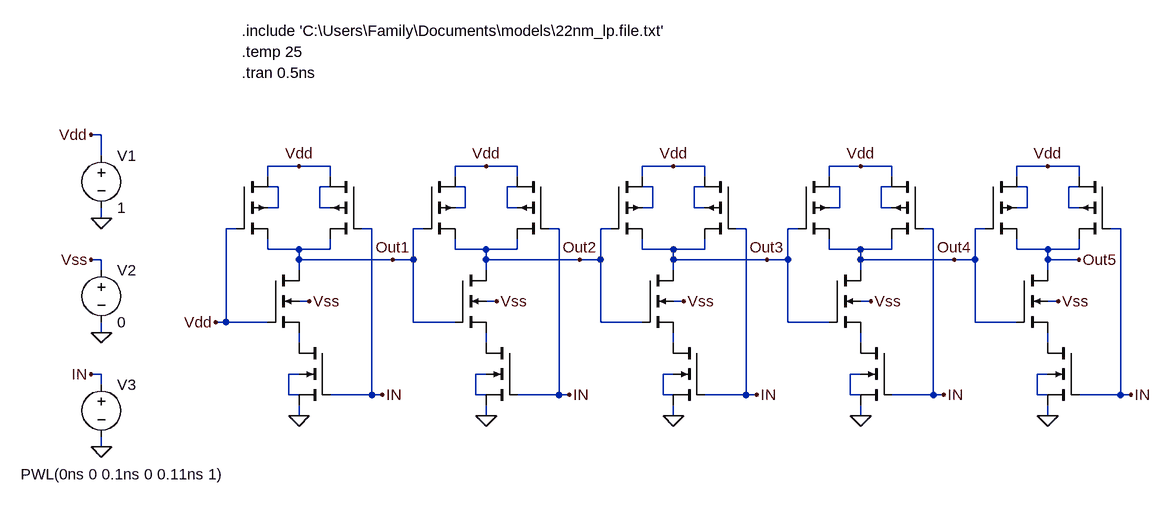
[diagram p0: schematic HW3_q1a.asc]
HW3_q1a.asc, the LTspice schematic file:
Version 4
SHEET 1 1404 720
WIRE -224 96 -240 96
WIRE -224 128 -224 96
WIRE 80 144 32 144
WIRE 128 144 80 144
WIRE 368 144 320 144
WIRE 416 144 368 144
WIRE 656 144 608 144
WIRE 704 144 656 144
WIRE 944 144 896 144
WIRE 992 144 944 144
WIRE 1232 144 1184 144
WIRE 1280 144 1232 144
WIRE 32 160 32 144
WIRE 128 160 128 144
WIRE 320 160 320 144
WIRE 416 160 416 144
WIRE 608 160 608 144
WIRE 704 160 704 144
WIRE 896 160 896 144
WIRE 992 160 992 144
WIRE 1184 160 1184 144
WIRE 1280 160 1280 144
WIRE 48 176 32 176
WIRE 128 176 112 176
WIRE 336 176 320 176
WIRE 416 176 400 176
WIRE 624 176 608 176
WIRE 704 176 688 176
WIRE 912 176 896 176
WIRE 992 176 976 176
WIRE 1200 176 1184 176
WIRE 1280 176 1264 176
WIRE 48 208 48 176
WIRE 48 208 32 208
WIRE 112 208 112 176
WIRE 128 208 112 208
WIRE 336 208 336 176
WIRE 336 208 320 208
WIRE 400 208 400 176
WIRE 416 208 400 208
WIRE 624 208 624 176
WIRE 624 208 608 208
WIRE 688 208 688 176
WIRE 704 208 688 208
WIRE 912 208 912 176
WIRE 912 208 896 208
WIRE 976 208 976 176
WIRE 992 208 976 208
WIRE 1200 208 1200 176
WIRE 1200 208 1184 208
WIRE 1264 208 1264 176
WIRE 1280 208 1264 208
WIRE -224 224 -224 208
WIRE -16 240 -32 240
WIRE 192 240 176 240
WIRE 272 240 256 240
WIRE 480 240 464 240
WIRE 560 240 544 240
WIRE 768 240 752 240
WIRE 848 240 832 240
WIRE 1056 240 1040 240
WIRE 1136 240 1120 240
WIRE 1344 240 1328 240
WIRE 32 272 32 256
WIRE 80 272 32 272
WIRE 128 272 128 256
WIRE 128 272 80 272
WIRE 320 272 320 256
WIRE 368 272 320 272
WIRE 416 272 416 256
WIRE 416 272 368 272
WIRE 608 272 608 256
WIRE 656 272 608 272
WIRE 704 272 704 256
WIRE 704 272 656 272
WIRE 896 272 896 256
WIRE 944 272 896 272
WIRE 992 272 992 256
WIRE 992 272 944 272
WIRE 1184 272 1184 256
WIRE 1232 272 1184 272
WIRE 1280 272 1280 256
WIRE 1280 272 1232 272
WIRE -224 288 -240 288
WIRE 80 288 80 272
WIRE 224 288 80 288
WIRE 256 288 256 240
WIRE 256 288 224 288
WIRE 368 288 368 272
WIRE 512 288 368 288
WIRE 544 288 544 240
WIRE 544 288 512 288
WIRE 656 288 656 272
WIRE 800 288 656 288
WIRE 832 288 832 240
WIRE 832 288 800 288
WIRE 944 288 944 272
WIRE 1088 288 944 288
WIRE 1120 288 1120 240
WIRE 1120 288 1088 288
WIRE 1232 288 1232 272
WIRE 1280 288 1232 288
WIRE -224 304 -224 288
WIRE 80 304 80 288
WIRE 368 304 368 288
WIRE 656 304 656 288
WIRE 944 304 944 288
WIRE 1232 304 1232 288
WIRE 96 352 80 352
WIRE 384 352 368 352
WIRE 672 352 656 352
WIRE 960 352 944 352
WIRE 1248 352 1232 352
WIRE -32 384 -32 240
WIRE -32 384 -48 384
WIRE 32 384 -32 384
WIRE 256 384 256 288
WIRE 320 384 256 384
WIRE 544 384 544 288
WIRE 608 384 544 384
WIRE 832 384 832 288
WIRE 896 384 832 384
WIRE 1120 384 1120 288
WIRE 1184 384 1120 384
WIRE -224 400 -224 384
WIRE 80 416 80 400
WIRE 368 416 368 400
WIRE 656 416 656 400
WIRE 944 416 944 400
WIRE 1232 416 1232 400
WIRE -224 464 -240 464
WIRE 80 464 64 464
WIRE 368 464 352 464
WIRE 656 464 640 464
WIRE 944 464 928 464
WIRE 1232 464 1216 464
WIRE -224 480 -224 464
WIRE 64 496 64 464
WIRE 80 496 64 496
WIRE 192 496 192 240
WIRE 192 496 128 496
WIRE 208 496 192 496
WIRE 352 496 352 464
WIRE 368 496 352 496
WIRE 480 496 480 240
WIRE 480 496 416 496
WIRE 496 496 480 496
WIRE 640 496 640 464
WIRE 656 496 640 496
WIRE 768 496 768 240
WIRE 768 496 704 496
WIRE 784 496 768 496
WIRE 928 496 928 464
WIRE 944 496 928 496
WIRE 1056 496 1056 240
WIRE 1056 496 992 496
WIRE 1072 496 1056 496
WIRE 1216 496 1216 464
WIRE 1232 496 1216 496
WIRE 1344 496 1344 240
WIRE 1344 496 1280 496
WIRE 1360 496 1344 496
WIRE 80 528 80 512
WIRE 368 528 368 512
WIRE 656 528 656 512
WIRE 944 528 944 512
WIRE 1232 528 1232 512
WIRE -224 576 -224 560
FLAG -224 224 0
FLAG -224 576 0
FLAG 80 144 Vdd
FLAG -224 400 0
FLAG 96 352 Vss
FLAG 80 528 0
FLAG 368 144 Vdd
FLAG 384 352 Vss
FLAG 368 528 0
FLAG 656 144 Vdd
FLAG 672 352 Vss
FLAG 656 528 0
FLAG 944 144 Vdd
FLAG 960 352 Vss
FLAG 944 528 0
FLAG 1232 144 Vdd
FLAG 1248 352 Vss
FLAG 1232 528 0
FLAG -48 384 Vdd
FLAG 208 496 IN
FLAG 496 496 IN
FLAG 784 496 IN
FLAG 1072 496 IN
FLAG 1360 496 IN
FLAG -240 96 Vdd
FLAG -240 288 Vss
FLAG -240 464 IN
FLAG 224 288 Out1
FLAG 512 288 Out2
FLAG 800 288 Out3
FLAG 1088 288 Out4
FLAG 1280 288 Out5
SYMBOL nmos4 128 416 M0
WINDOW 0 56 32 Invisible 2
WINDOW 3 56 72 Invisible 2
SYMATTR InstName M1
SYMATTR Value2 l=0.03u w=0.8u
SYMBOL nmos4 32 304 R0
WINDOW 0 56 32 Invisible 2
WINDOW 3 56 72 Invisible 2
SYMATTR InstName M2
SYMATTR Value2 l=0.03u w=0.8u
SYMBOL pmos4 -16 160 R0
WINDOW 0 56 32 Invisible 2
WINDOW 3 56 72 Invisible 2
SYMATTR InstName M3
SYMATTR Value2 l=0.03u w=0.7u
SYMBOL pmos4 176 160 M0
WINDOW 0 56 32 Invisible 2
WINDOW 3 56 72 Invisible 2
SYMATTR InstName M4
SYMATTR Value2 l=0.03u w=0.7u
SYMBOL voltage -224 112 R0
SYMATTR InstName V1
SYMATTR Value 1
SYMBOL voltage -224 464 R0
WINDOW 3 -124 154 Left 2
WINDOW 123 0 0 Left 2
WINDOW 39 0 0 Left 2
SYMATTR Value PWL(0ns 0 0.1ns 0 0.11ns 1)
SYMATTR InstName V3
SYMBOL voltage -224 288 R0
SYMATTR InstName V2
SYMATTR Value 0
SYMBOL nmos4 416 416 M0
WINDOW 0 56 32 Invisible 2
WINDOW 3 56 72 Invisible 2
SYMATTR InstName M5
SYMATTR Value2 l=0.03u w=0.8u
SYMBOL nmos4 320 304 R0
WINDOW 0 56 32 Invisible 2
WINDOW 3 56 72 Invisible 2
SYMATTR InstName M6
SYMATTR Value2 l=0.03u w=0.8u
SYMBOL pmos4 272 160 R0
WINDOW 0 56 32 Invisible 2
WINDOW 3 56 72 Invisible 2
SYMATTR InstName M7
SYMATTR Value2 l=0.03u w=0.7u
SYMBOL pmos4 464 160 M0
WINDOW 0 56 32 Invisible 2
WINDOW 3 56 72 Invisible 2
SYMATTR InstName M8
SYMATTR Value2 l=0.03u w=0.7u
SYMBOL nmos4 704 416 M0
WINDOW 0 56 32 Invisible 2
WINDOW 3 56 72 Invisible 2
SYMATTR InstName M9
SYMATTR Value2 l=0.03u w=0.8u
SYMBOL nmos4 608 304 R0
WINDOW 0 56 32 Invisible 2
WINDOW 3 56 72 Invisible 2
SYMATTR InstName M10
SYMATTR Value2 l=0.03u w=0.8u
SYMBOL pmos4 560 160 R0
WINDOW 0 56 32 Invisible 2
WINDOW 3 56 72 Invisible 2
SYMATTR InstName M11
SYMATTR Value2 l=0.03u w=0.7u
SYMBOL pmos4 752 160 M0
WINDOW 0 56 32 Invisible 2
WINDOW 3 56 72 Invisible 2
SYMATTR InstName M12
SYMATTR Value2 l=0.03u w=0.7u
SYMBOL nmos4 992 416 M0
WINDOW 0 56 32 Invisible 2
WINDOW 3 56 72 Invisible 2
SYMATTR InstName M13
SYMATTR Value2 l=0.03u w=0.8u
SYMBOL nmos4 896 304 R0
WINDOW 0 56 32 Invisible 2
WINDOW 3 56 72 Invisible 2
SYMATTR InstName M14
SYMATTR Value2 l=0.03u w=0.8u
SYMBOL pmos4 848 160 R0
WINDOW 0 56 32 Invisible 2
WINDOW 3 56 72 Invisible 2
SYMATTR InstName M15
SYMATTR Value2 l=0.03u w=0.7u
SYMBOL pmos4 1040 160 M0
WINDOW 0 56 32 Invisible 2
WINDOW 3 56 72 Invisible 2
SYMATTR InstName M16
SYMATTR Value2 l=0.03u w=0.7u
SYMBOL nmos4 1280 416 M0
WINDOW 0 56 32 Invisible 2
WINDOW 3 56 72 Invisible 2
SYMATTR InstName M17
SYMATTR Value2 l=0.03u w=0.8u
SYMBOL nmos4 1184 304 R0
WINDOW 0 56 32 Invisible 2
WINDOW 3 56 72 Invisible 2
SYMATTR InstName M18
SYMATTR Value2 l=0.03u w=0.8u
SYMBOL pmos4 1136 160 R0
WINDOW 0 56 32 Invisible 2
WINDOW 3 56 72 Invisible 2
SYMATTR InstName M19
SYMATTR Value2 l=0.03u w=0.7u
SYMBOL pmos4 1328 160 M0
WINDOW 0 56 32 Invisible 2
WINDOW 3 56 72 Invisible 2
SYMATTR InstName M20
SYMATTR Value2 l=0.03u w=0.7u
TEXT -8 -64 Left 2 !.include 'C:\\Users\\Family\\Documents\\models\\22nm_lp.file.txt'
TEXT -8 -32 Left 2 !.temp 25
TEXT -8 0 Left 2 !.tran 0.5ns

The netlist it stands for:
* HW3_q1a.asc
M1 N011 IN 0 N016 NMOS l=0.03u w=0.8u
M2 Out1 Vdd N011 Vss NMOS l=0.03u w=0.8u
M3 Vdd Vdd Out1 N001 PMOS l=0.03u w=0.7u
M4 Vdd IN Out1 N002 PMOS l=0.03u w=0.7u
V1 Vdd 0 1
V3 IN 0 PWL(0ns 0 0.1ns 0 0.11ns 1)
V2 Vss 0 0
M5 N012 IN 0 N017 NMOS l=0.03u w=0.8u
M6 Out2 Out1 N012 Vss NMOS l=0.03u w=0.8u
M7 Vdd Out1 Out2 N003 PMOS l=0.03u w=0.7u
M8 Vdd IN Out2 N004 PMOS l=0.03u w=0.7u
M9 N013 IN 0 N018 NMOS l=0.03u w=0.8u
M10 Out3 Out2 N013 Vss NMOS l=0.03u w=0.8u
M11 Vdd Out2 Out3 N005 PMOS l=0.03u w=0.7u
M12 Vdd IN Out3 N006 PMOS l=0.03u w=0.7u
M13 N014 IN 0 N019 NMOS l=0.03u w=0.8u
M14 Out4 Out3 N014 Vss NMOS l=0.03u w=0.8u
M15 Vdd Out3 Out4 N007 PMOS l=0.03u w=0.7u
M16 Vdd IN Out4 N008 PMOS l=0.03u w=0.7u
M17 N015 IN 0 N020 NMOS l=0.03u w=0.8u
M18 Out5 Out4 N015 Vss NMOS l=0.03u w=0.8u
M19 Vdd Out4 Out5 N009 PMOS l=0.03u w=0.7u
M20 Vdd IN Out5 N010 PMOS l=0.03u w=0.7u
.model NMOS NMOS
.model PMOS PMOS
.lib standard.mos
.include 'C:\Users\Family\Documents\models\22nm_lp.file.txt'
.temp 25
.tran 0.5ns
.backanno
.end